# Altium schematic sheet FLASHLIGHT_MAIN_SCH.SchDoc
size 1651 x 1651 mm
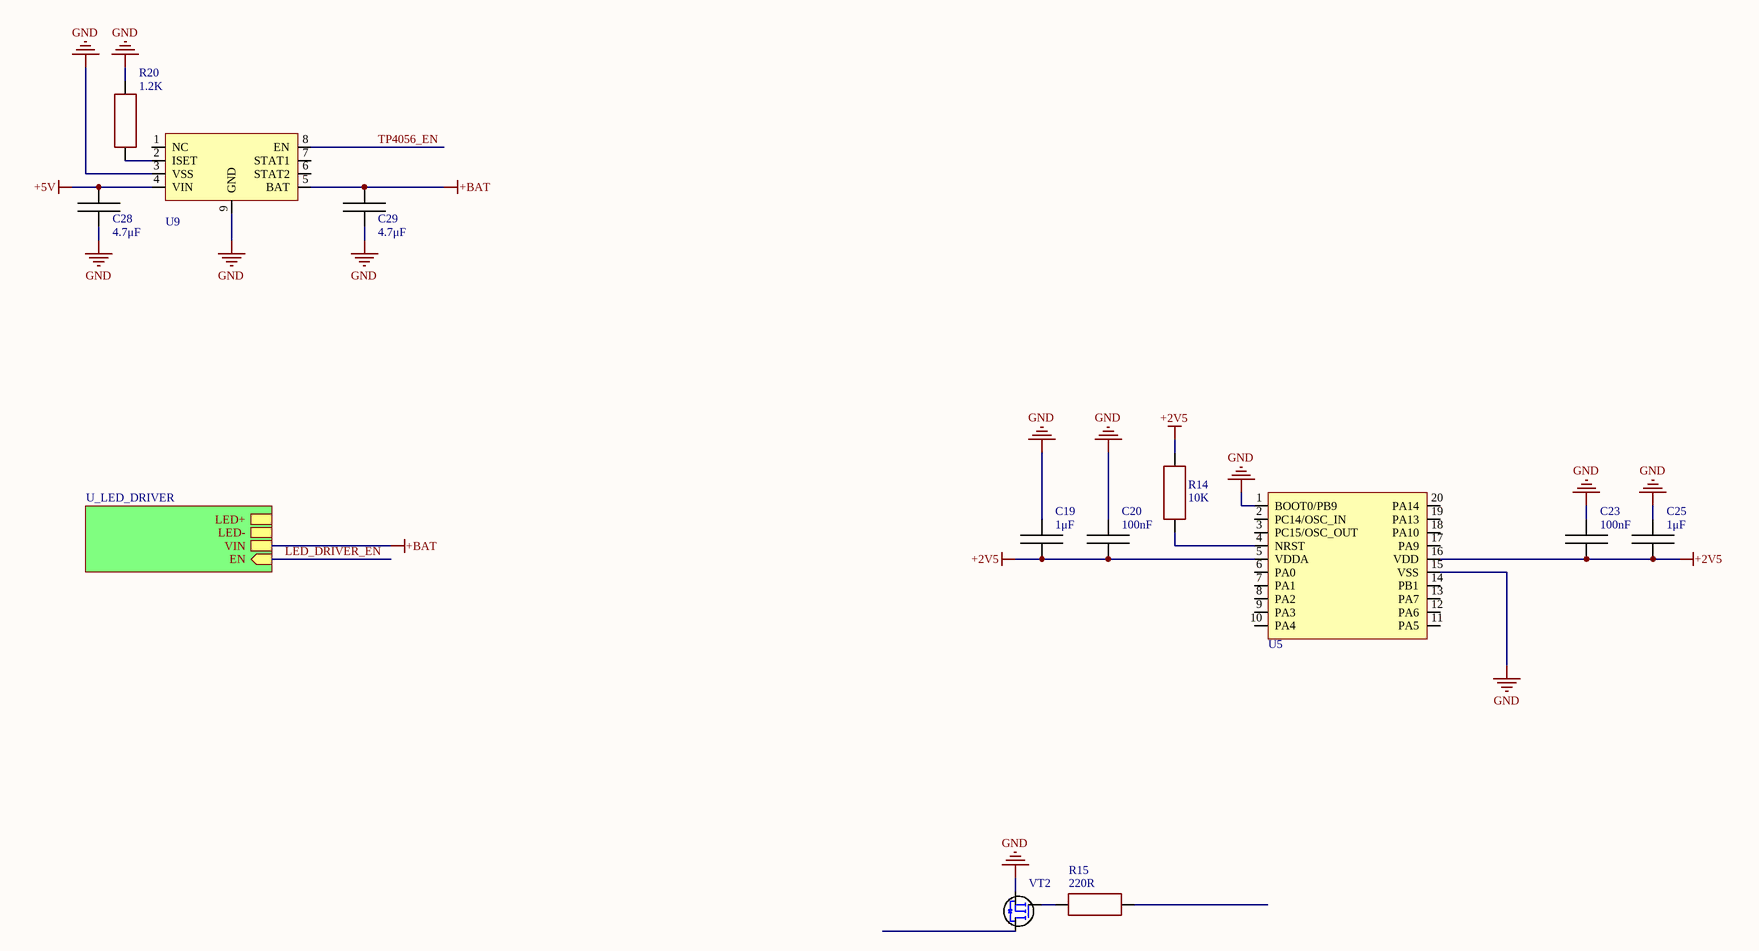
[diagram p0: FLASHLIGHT_MAIN_SCH.SchDoc]

## Parts
C19  value 1μF  [CAP: 0402]  (hidden comment: Cap_0402)
C20  value 100nF  [CAP: 0402]  (hidden comment: Cap_0402)
C23  value 100nF  [CAP: 0402]  (hidden comment: Cap_0402)
C25  value 1μF  [CAP: 0402]  (hidden comment: Cap_0402)
C28  value 4.7μF  [CAP: 0402]  (hidden comment: Cap_0402)
C29  value 4.7μF  [CAP: 0402]  (hidden comment: Cap_0402)
R14  value 10K  [RES: 0402]
R15  value 220R  [RES: 0402]
R20  value 1.2K  [RES: 0402]
U5  STM32L011F4P6TR  [TSSOP-20]  (value not drawn)
U9  TP4056  [ESOP-8]  (value not drawn)
VT2  IRLML6344  [SOT-23-3]  (value not drawn)

## Sub-sheets
U_LED_DRIVER = LED_DRIVER.SchDoc: LED+, VIN, LED-, EN (in)

## Nets
+2V5: C19.1 C20.2 C23.2 C25.1 R14.1 U5.5(VDDA) U5.16(VDD)
+5V: C28.2 U9.4(VIN)
+BAT: C29.2 U9.5(BAT) ; sheet U_LED_DRIVER/VIN
GND: C19.2 C20.1 C23.1 C25.2 C28.1 C29.1 R20.2 U5.1(BOOT0/PB9) U5.15(VSS) U9.3(VSS) U9.9(GND) VT2.2
LED_DRIVER_EN: sheet U_LED_DRIVER/EN
TP4056_EN: U9.8(EN)
NetR14_2: R14.2 U5.4(NRST)
NetR15_1: R15.1 VT2.1
NetR20_1: R20.1 U9.2(ISET)

Not connected (* = marked no-connect by the designer): R15 2; U5 2(PC14/OSC_IN) 3(PC15/OSC_OUT) 6(PA0) 7(PA1) 8(PA2) 9(PA3) 10(PA4) 11(PA5) 12(PA6) 13(PA7) 14(PB1) 17(PA9) 18(PA10) 19(PA13) 20(PA14); U9 1(NC) 6(STAT2) 7(STAT1); VT2 3

## Library data of the parts
C19 C20 C23 C25 = Cap_0402: TypeDielectric: X7R(X5R); Voltage: ??V; Package/Case: 0402; Temperature: -55...+125°C(-55...+85°C); Product Category: Capacitors
C28 C29 = Cap_0402: TypeDielectric: X7R(X5R); Voltage: X5R 6.3В 20%; Package/Case: 0402; Temperature: -55...+125°C(-55...+85°C); Product Category: Capacitors
R14 R15 R20 = Resistor_0402: Tolerance: ±5%; Product Category: Resistors; Package/Case: 0402; Temperature: -55...+125°C
U5 = STM32L011F4P6TR: Manufacturer: STMicroelectronics; Datasheet: https://static.chipdip.ru/lib/696/DOC011696872.pdf; HelpURL: https://www.chipdip.by/product0/8007122304; Package/Case: TSSOP-20; Product Category: Microcontrollers; Value: STM32L011F4P6TR
U9 = TP4056: 1s charge module; Manufacturer: UMW; Datasheet: https://static.chipdip.ru/lib/848/DOC018848830.pdf; HelpURL: https://www.chipdip.by/product/tp4056-umw; Package/Case: ESOP-8; Product Category: Charge modules; Value: TP4056
VT2 = IRLML6344: MOSFET N-CHANNEL 30V 5A; Manufacturer: Fairchild; Analogue: NX7002AK; Datasheet: https://static.chipdip.ru/lib/015/DOC024015069.pdf; HelpURL: https://eu.mouser.com/ProductDetail/onsemi-Fairchild/2N7002?qs=0dwsXDNhqlz66WJJhrTFjQ%3D%3D; Package/Case: SOT-23; Product Category: MOSFET; Value: IRLML6344